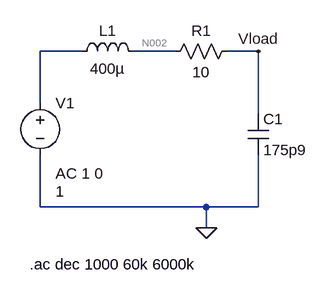
[diagram p0: schematic Experiment 7B.asc]
Experiment 7B.asc, the LTspice schematic file:
Version 4
SHEET 1 880 680
WIRE 160 32 96 32
WIRE 304 32 240 32
WIRE 432 32 384 32
WIRE 96 112 96 32
WIRE 432 128 432 32
WIRE 96 272 96 192
WIRE 352 272 96 272
WIRE 432 272 432 192
WIRE 432 272 352 272
WIRE 352 304 352 272
FLAG 352 304 0
FLAG 432 32 Vload
SYMBOL voltage 96 96 R0
WINDOW 3 24 152 Left 2
WINDOW 123 24 124 Left 2
WINDOW 39 0 0 Left 0
SYMATTR Value 1
SYMATTR Value2 AC 1 0
SYMATTR InstName V1
SYMBOL res 400 16 R90
WINDOW 0 0 56 VBottom 2
WINDOW 3 32 56 VTop 2
SYMATTR InstName R1
SYMATTR Value 10
SYMBOL cap 416 128 R0
SYMATTR InstName C1
SYMATTR Value 175p9
SYMBOL ind 144 48 R270
WINDOW 0 32 56 VTop 2
WINDOW 3 5 56 VBottom 2
SYMATTR InstName L1
SYMATTR Value 400µ
TEXT 80 360 Left 2 !.ac dec 1000 60k 6000k

The netlist it stands for:
* Experiment 7B.asc
V1 N001 0 1 AC 1 0
R1 Vload N002 10
C1 Vload 0 175p9
L1 N001 N002 400µ
.ac dec 1000 60k 6000k
.backanno
.end

* Results of the author's LTspice run, read from the files saved beside the schematic
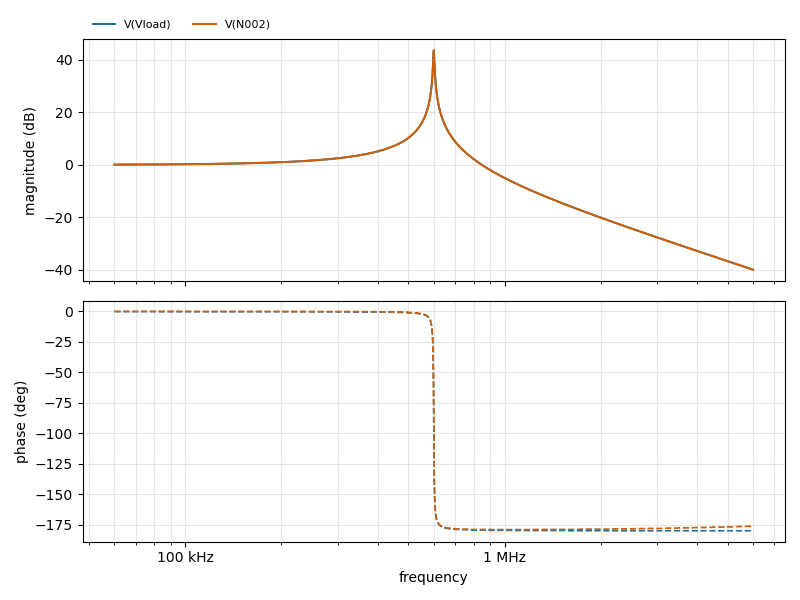
[diagram p1: AC Analysis of Experiment 7B.asc, plotted from the saved traces]
* AC Analysis, 1 run:
*   V(Vload): 0.09 dB at 60 kHz, -39.91 dB at 6 MHz, peak 43.57 dB at 600 kHz, 3 dB below the peak at 598 kHz and 602 kHz
*   V(N002): 0.09 dB at 60 kHz, -39.89 dB at 6 MHz, peak 43.57 dB at 600 kHz, 3 dB below the peak at 598 kHz and 602 kHz